# EAGLE design Sensor_PCB_M2 (EAGLE 9.7.0)
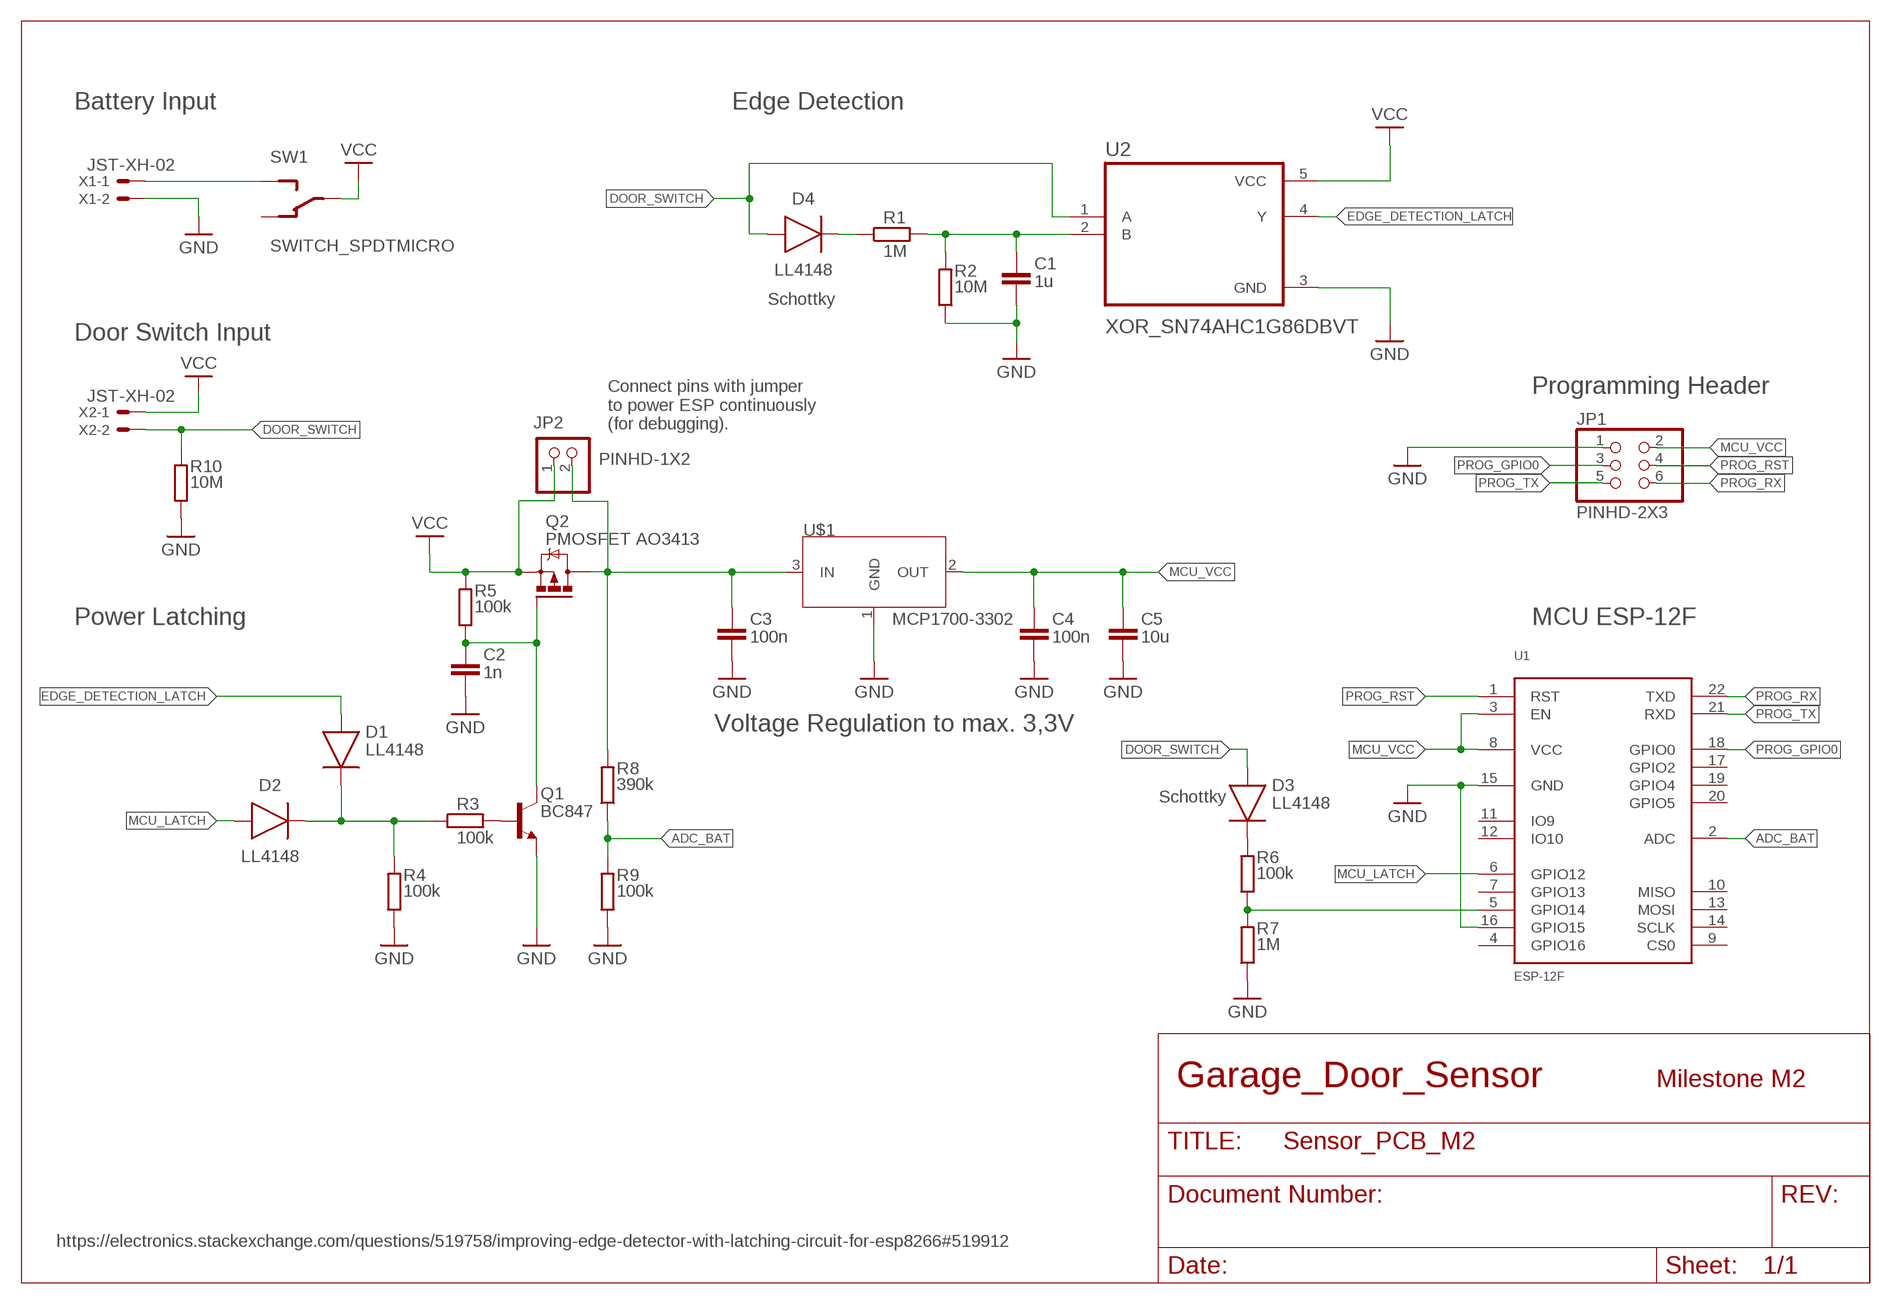
[diagram p0: schematic, sheet 1]

## Parts
C1  1u  C_CHIP-0805(2012-METRIC)  [CAPC2012X110]
C2  1n  C_CHIP-0805(2012-METRIC)  [CAPC2012X110]
C3  100n  C_CHIP-0805(2012-METRIC)  [CAPC2012X110]
C4  100n  C_CHIP-0805(2012-METRIC)  [CAPC2012X110]
C5  10u  C_CHIP-0805(2012-METRIC)  [CAPC2012X110]
D1  LL4148  DIODE_LL4148_SOD-80  [DIOMELF3516]
D2  LL4148  DIODE_LL4148_SOD-80  [DIOMELF3516]
D3  LL4148  DIODE_LL4148_SOD-80  [DIOMELF3516]
D4  LL4148  DIODE_LL4148_SOD-80  [DIOMELF3516]
JP1  PINHD-2X3  [2X03]
JP2  PINHD-1X2  [1X02]
Q1  BC847  NPN_SOT23-BEC  [SOT95P237X112-3N]
Q2  PMOSFET AO3413  PMOSFET_SOT23-GSD  [SOT23]
R1  1M  R-EU_R0805  [R0805]
R2  10M  R-EU_R0805  [R0805]
R3  100k  R-EU_R0805  [R0805]
R4  100k  R-EU_R0805  [R0805]
R5  100k  R-EU_R0805  [R0805]
R6  100k  R-EU_R0805  [R0805]
R7  1M  R-EU_R0805  [R0805]
R8  390k  R-EU_R0805  [R0805]
R9  100k  R-EU_R0805  [R0805]
R10  10M  R-EU_R0805  [R0805]
SW1  SWITCH_SPDTMICRO  [MICROSWITCH_SPDT]
U1  ESP-12F  [ESP-12F]
U2  XOR_SN74AHC1G86DBVT  SN74AHC1G86DBVT  [SOT95P280X145-5N]
U$1  MCP1700-3302  [SOT23]
X1  JST-XH-02  JST-XH-02-PIN-LONG-PAD  [JST-XH-02-PACKAGE-LONG-PAD]
X2  JST-XH-02  JST-XH-02-PIN-LONG-PAD  [JST-XH-02-PACKAGE-LONG-PAD]

## Nets
ADC_BAT: R8.1 R9.2 U1.2(ADC)
DOOR_SWITCH: D3.2(A) D4.2(A) R10.2 U2.1(A) X2.2
EDGE_DETECTION_LATCH: D1.2(A) U2.4(Y)
GND: C1.2 C2.2 C3.2 C4.2 C5.2 JP1.1 Q1.2(E) R2.1 R4.1 R7.1 R9.1 R10.1 U1.15(GND) U1.16(GPIO15) U2.3(GND) U$1.1(GND) X1.2
MCU_LATCH: D2.2(A) U1.6(GPIO12)
MCU_VCC: C4.1 C5.1 JP1.2 U1.3(EN) U1.8(VCC) U$1.2(OUT)
N$1: C1.1 R1.2 R2.2 U2.2(B)
N$2: D4.1(C) R1.1
N$3: Q1.1(B) R3.2
N$4: D1.1(C) D2.1(C) R3.1 R4.2
N$5: C2.1 Q1.3(C) Q2.1(G) R5.1
N$6: D3.1(C) R6.2
N$7: R6.1 R7.2 U1.5(GPIO14)
N$8: SW1.P$1 X1.1
N$9: C3.1 JP2.2 Q2.3(D) R8.2 U$1.3(IN)
PROG_GPIO0: JP1.3 U1.18(GPIO0)
PROG_RST: JP1.4 U1.1(RST)
PROG_RX: JP1.6 U1.22(TXD)
PROG_TX: JP1.5 U1.21(RXD)
VCC: JP2.1 Q2.2(S) R5.2 SW1.P$2 U2.5(VCC) X2.1
Unconnected: SW1.P$3 U1.4(GPIO16) U1.7(GPIO13) U1.9(CS0) U1.10(MISO) U1.11(IO9) U1.12(IO10) U1.13(MOSI) U1.14(SCLK) U1.17(GPIO2) U1.19(GPIO4) U1.20(GPIO5)

## Notes on the sheet
- Battery Input | Edge Detection
- Schottky
- Door Switch Input
- Programming Header
- Connect pins with jumper
  to power ESP continuously
  (for debugging).
- Power Latching | MCU ESP-12F
- Voltage Regulation to max. 3,3V
- Schottky
- Garage_Door_Sensor | Milestone M2
- https://electronics.stackexchange.com/questions/519758/improving-edge-detector-with-latching-circuit-for-esp8266#519912

## Library data of the parts
C1-C5 = Capacitor:C: Capacitor - Generic; CATEGORY: Capacitor
D1-D4 = Diode:DIODE_: Diode Rectifier - Popular parts; CATEGORY: Diode; DESCRIPTION: DIODE GEN PURP 100V 200MA SOD80; MANUFACTURER: ON Semiconductor; SUB-CATEGORY: Rectifier
JP1 = Connector:PINHD-2X3: PIN HEADER; CATEGORY: Headers; DESCRIPTION: Header, Straight, 2x3 Position; MANUFACTURER: Generic; MPN: Generic; OPERATING_TEMPERATURE: Generic; PART_STATUS: Active; PITCH: 0.100" (2.54mm); ROHS_COMPLIANCE: Generic; SERIES: Generic; SUB-CATEGORY: Headers, Male Pins; TYPE: Board to Board or Cable, Unshrouded, Through Hole, Straight
JP2 = Connector:PINHD-1X2: PIN HEADER; CATEGORY: Headers; DESCRIPTION: Header, Straight, 2 Position; MANUFACTURER: Generic; MPN: Generic; OPERATING_TEMPERATURE: Generic; PART_STATUS: Active; PITCH: 0.100" (2.54mm); ROHS_COMPLIANCE: Generic; SERIES: Generic; SUB-CATEGORY: Headers, Male Pins; TYPE: Board to Board or Cable, Unshrouded, Through Hole, Straight
Q1 = Transistor:NPN: NPN - Generic; CATEGORY: Transistor; SUB-CATEGORY: BJT; TYPE: NPN; VALUE: NPN
Q2 = Transistor:PMOSFET: P-Channel MOSFET - Generic; CATEGORY: Transistor; SUB-CATEGORY: MOSFET; TYPE: P-Channel; VALUE: PMOSFET
R1-R10 = OwnDevices:R-EU_: RESISTOR, European symbol; SPICEPREFIX: R
SW1 = OwnDevices:SWITCH_SPDT: https://www.roboter-bausatz.de/p/kippschalter-spdt-3a-250v-mts-102-ein-ein?number=RBS15499 Kleiner Kippschalter für DIY-Elektronik, RC-Modellbau oder Auto. Durch die Schalterstellungen Ein-Ein (Wechselschalter) können mit diesem Kippschalter zwei Stromkreise geschaltet werden. In jeder Position wird ein Stromkreis geöffnet und der andere gleichzeitig geschlossen. Der Schalter benötigt zum Einbau eine Frontplatte oder eine 6mm Bohrung. Details Schaltleistung: 3A/250V Kontaktwiderstand: < 20 mOhm Isolationswiderstand: > 1000 MOhm Durchschlagfestigkeit: 1500V~ (1 min.) Betriebstemperatur: -25~+85°C Schaltzyklen: 10.000 MTS-102 Schaltzustand: EIN - EIN Typ: SPDT Pins: 3
U1 = OwnDevices:ESP-12F: 317060163 Check availability <https://pricing.snapeda.com/parts/ESP-12F/AI-Thinker/view-part?ref=eda>; AVAILABILITY: Not in stock; CHECK_PRICES: https://www.snapeda.com/parts/ESP-12F/AI-Thinker/view-part/?ref=eda; DESCRIPTION: WiFi Module; MF: AI-Thinker; MP: ESP-12F; PACKAGE: Package; PRICE: None; SNAPEDA_LINK: https://www.snapeda.com/parts/ESP-12F/AI-Thinker/view-part/?ref=snap
U2 = OwnDevices:SN74AHC1G86DBVT: Check availability <https://pricing.snapeda.com/parts/SN74AHC1G86DBVT/Texas%20Instruments/view-part?ref=eda>; AVAILABILITY: In Stock; CHECK_PRICES: https://www.snapeda.com/parts/SN74AHC1G86DBVT/Texas+Instruments/view-part/?ref=eda; DESCRIPTION: Single 2-input, 2-V to 5.5-V XOR (exclusive OR) gate; MF: Texas Instruments; MP: SN74AHC1G86DBVT; PACKAGE: SOT-23-5 Texas Instruments; PRICE: None; PURCHASE-URL: https://www.snapeda.com/api/url_track_click_mouser/?unipart_id=297926&manufacturer=Texas Instruments&part_name=SN74AHC1G86DBVT&search_term=1-ch, 2-input xor gate; SNAPEDA_LINK: https://www.snapeda.com/parts/SN74AHC1G86DBVT/Texas+Instruments/view-part/?ref=snap
U$1 = OwnDevices:MCP1700-3302
X1 X2 = OwnDevices:JST-XH-02-PIN: JST XH Connector 2 Pin Wire to board connector. Pitch: 2,54 mm, (0.100") Number of pins: 2 Created by Rembrandt Electronics www.rembrandtelectronics.com

## Board
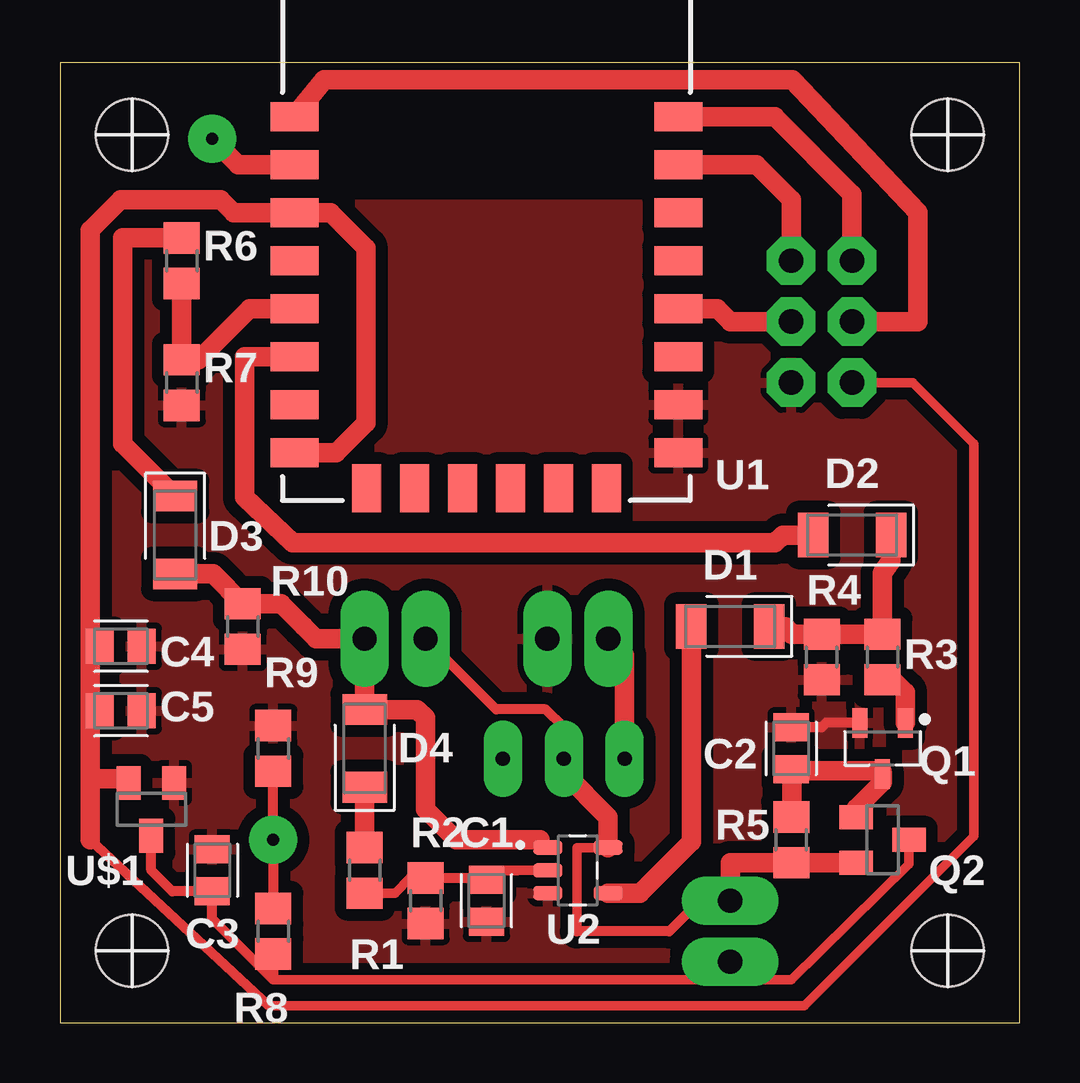
[diagram p1: board, top side]
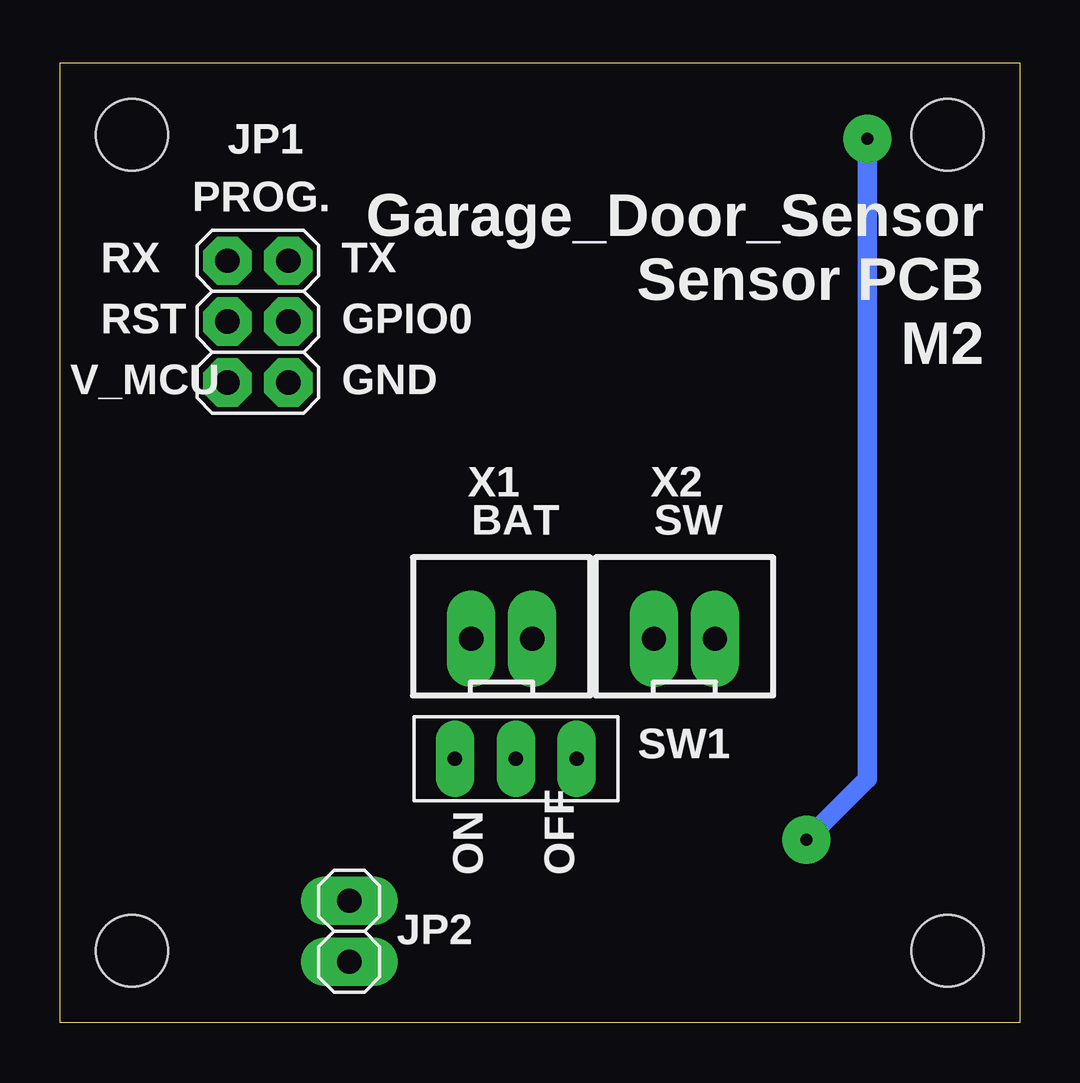
[diagram p2: board, bottom side, seen from below]

Size 40 x 40 mm. Coordinates in mm from the lower left corner, seen from the top.
Outline: 0,0 40,0 40,40 0,40 0,0
Copper layers (1*16): Top 0.035mm / dielectric 1.5mm / Bottom 0.035mm
Design rules "ownDesignRules2 *": minimum track width 0.4mm, minimum drill 0.5mm, track to track 0.35mm, track to pad 0.25mm, pad to pad 6mil, via to via 6mil, smd to smd 6mil, copper to edge 0mil, drill to drill 6mil, minimum pad ring 0.5mm, minimum via ring 8mil, stop-mask expansion 4mil, vias tented up to drill 0mil, thermal gap 10mil
Holes 3 mm at 3,3 37,37 37,3 3,37

### Footprints (pad centres in the part's own frame; a part is rotated, then mirrored left to right if it is on the bottom)
CAPC2012X110 = smd 1.165 x 1.465: 1 -0.875,0; 2 0.875,0
DIOMELF3516 = smd 1.275 x 1.85: 1 -1.62,0; 2 1.62,0
2X03 = drill 1.016 octagon: 1 -2.54,-1.27; 2 -2.54,1.27; 3 0,-1.27; 4 0,1.27; 5 2.54,-1.27; 6 2.54,1.27
1X02 = drill 1.016 long: 1 -1.27,0; 2 1.27,0
SOT95P237X112-3N = smd 1.224 x 0.625: 1 -1.064,0.95; 2 -1.064,-0.95; 3 1.064,0
SOT23 = smd 1 x 1.4: 1 -0.95,-1.1; 2 0.95,-1.1; 3 0,1.1
R0805 = smd 1.3 x 1.5: 1 -0.95,0; 2 0.95,0
MICROSWITCH_SPDT = drill 0.6 long: P$1 -2.54,0; P$2 0,0; P$3 2.54,0
ESP-12F = smd 2 x 1.2: 1 -8,3.48; 2 -8,1.48; 3 -8,-0.52; 4 -8,-2.52; 5 -8,-4.52; 6 -8,-6.52; 7 -8,-8.52; 8 -8,-10.52; 15 8,-10.52; 16 8,-8.52; 17 8,-6.52; 18 8,-4.52; 19 8,-2.52; 20 8,-0.52; 21 8,1.48; 22 8,3.48 | smd 1.2 x 2: 9 -5,-12; 10 -3,-12; 11 -1,-12; 12 1,-12; 13 3,-12; 14 5,-12
SOT95P280X145-5N = smd 1.21 x 0.59: 1 -1.255,0.95; 2 -1.255,0; 3 -1.255,-0.95; 4 1.255,-0.95; 5 1.255,0.95
JST-XH-02-PACKAGE-LONG-PAD = drill 1.016 long: 1 -1.27,0; 2 1.27,0

### Placement (x,y rotation side)
C1  17.78,5.08 270 top
C2  30.48,11.43 90 top
C3  6.35,6.35 90 top
C4  2.54,15.69 0 top
C5  2.54,13 0 top
D1  27.94,16.51 180 top
D2  33.02,20.32 180 top
D3  4.8,20.32 270 top
D4  12.7,11.43 90 top
JP1  31.75,29.21 90 bottom
JP2  27.94,3.81 270 bottom
Q1  34.29,11.43 270 top
Q2  34.29,7.62 270 top
R1  12.7,6.35 270 top
R2  15.24,5.08 90 top
R3  34.29,15.24 270 top
R4  31.75,15.24 90 top
R5  30.48,7.62 270 top
R6  5.08,31.75 90 top
R7  5.08,26.67 90 top
R8  8.89,3.81 270 top
R9  8.89,11.43 270 top
R10  7.62,16.51 90 top
SW1  21,11 0 bottom
U1  17.78,34.26 0 top
U2  21.59,6.35 0 top
U$1  3.81,8.89 180 top
X1  21.59,16 0 bottom
X2  13.97,16 0 bottom

### Tracks (layer width: path | path; a pad name or v marks a point on that pad's centre or on a via)
ADC_BAT  (via drill 0.5 pad 2)
  Top 0.406: R9.2 v8.89,7.62 R8.1
  Top 0.813: U1.2 7.44,35.74 v6.35,36.83
  Bottom 0.813: v6.35,36.83 6.35,10.16 v8.89,7.62
DOOR_SWITCH
  Top 0.406: U2.1 20.02,7.62
  Top 0.813: 20.02,7.62 16.51,7.62 15.24,8.89 15.24,12.7 14.89,13.05 D4.2 X2.2 10.67,16 10.16,16.51 9.21,17.46 R10.2 6.38,18.7 D3.2
EDGE_DETECTION_LATCH
  Top 0.813: D1.2 26.32,7.55 24.17,5.4 U2.4
GND
  Top 0.4: 33.27,12.5 Q1.2
  Top 0.406: 17.7,4.13 C1.2 | C2.2 31.75,12.3 31.95,12.5 33.27,12.5
  pour Top (isolate 0.5): 0.2,0.2 40.44,0.2 40.44,34.09 0.2,34.09
MCU_LATCH
  Top 0.813: U1.6 7.7,27.74 7.7,21.9 9.7,20 29.81,20 30.13,20.32 D2.2
MCU_VCC
  Top 0.4: 1.27,7.62 8.69,0.7 31.03,0.7 38.1,7.77 38.1,24.13 35.56,26.67 JP1.2 | 1.27,15.24 1.67,15.63 C4.1
  Top 0.406: U$1.2 2.69,10.16 | C5.1 1.36,12.7 1.27,12.7
  Top 0.813: U1.8 11.51,23.74 12.77,25 12.77,32.26 11.29,33.74 U1.3 7.24,33.74 6.69,34.29 2.54,34.29 1.27,33.02 1.27,15.24 1.27,12.7 1.27,11.43 1.27,10.16 | 1.27,10.16 1.27,7.62 | 2.69,10.16 1.27,10.16
N$1
  Top 0.4: 19.07,6.35 U2.2 | R2.2 14.6,6.03 13.97,5.4 R1.2
  Top 0.406: R2.2 17.7,6.03 C1.1 18.18,6.35 19.07,6.35
N$2
  Top 0.813: D4.1 R1.1
N$3
  Top 0.813: R3.2 34.71,14.29 35.24,13.76 Q1.1
N$4
  Top 0.4: D1.1
  Top 0.813: D1.1 30.23,16.5 30.48,16.19 R4.2 R3.1 34.29,18.73 34.64,19.25 D2.1
N$5
  Top 0.4: 30.5,10.5 C2.1
  Top 0.813: Q2.1 33.19,8.93 34.29,10.03 Q1.3 34.27,10.5 30.5,10.5 30.5,8.59 R5.1
N$6
  Top 0.813: R6.2 2.61,32.7 2.61,24.39 2.61,24.13 D3.1
N$7
  Top 0.813: R6.1 R7.2 5.79,27.62 7.91,29.74 U1.5
N$8
  Top 0.813: SW1.P$1 23.54,15.32 X1.1
N$9
  Top 0.4: Q2.3 35.39,6.61 30.48,1.8 29.21,1.8 27.94,1.8 | 27.94,1.8 8.89,1.8 | JP2.2 27.94,1.8
  Top 0.406: U$1.3 3.81,6.35 4.68,5.47 C3.1 6.35,4.34 8.89,1.8 R8.2
PROG_GPIO0
  Top 0.813: U1.18 27.41,29.74 27.94,29.21 JP1.3
PROG_RST
  Top 0.813: U1.1 9.78,37.78 11,39.3 30.54,39.3 35.77,33.77 35.77,29.21 JP1.4
PROG_RX
  Top 0.813: U1.22 29.8,37.74 33.02,34.52 JP1.6
PROG_TX
  Top 0.813: U1.21 29.03,35.74 30.48,34.29 JP1.5
VCC
  Top 0.4: U2.5 21.55,7.3 21.55,3.81
  Top 0.406: X2.1 18.19,13.05 20.25,13.05 21,12.3 SW1.P$2 | JP2.1 26.67,5.08 25.4,3.81 21.55,3.81
  Top 0.813: Q2.2 R5.2 29.21,6.67 27.94,6.67 JP2.1 | SW1.P$2 21,10.41 22.84,8.57 U2.5

### Text on the board
bNames: PROG. | TX | RX | GPIO0 | RST | Garage_Door_Sensor / Sensor PCB / M2 | GND | V_MCU | SW | BAT | OFF | ON